# Altium schematic sheet Sheet1.SchDoc
size A3; Organization: Altium Limited; Address1: L3, 12a Rodborough Rd; Address2: Frenchs Forest; Address3: NSW; Address4: Australia 2086
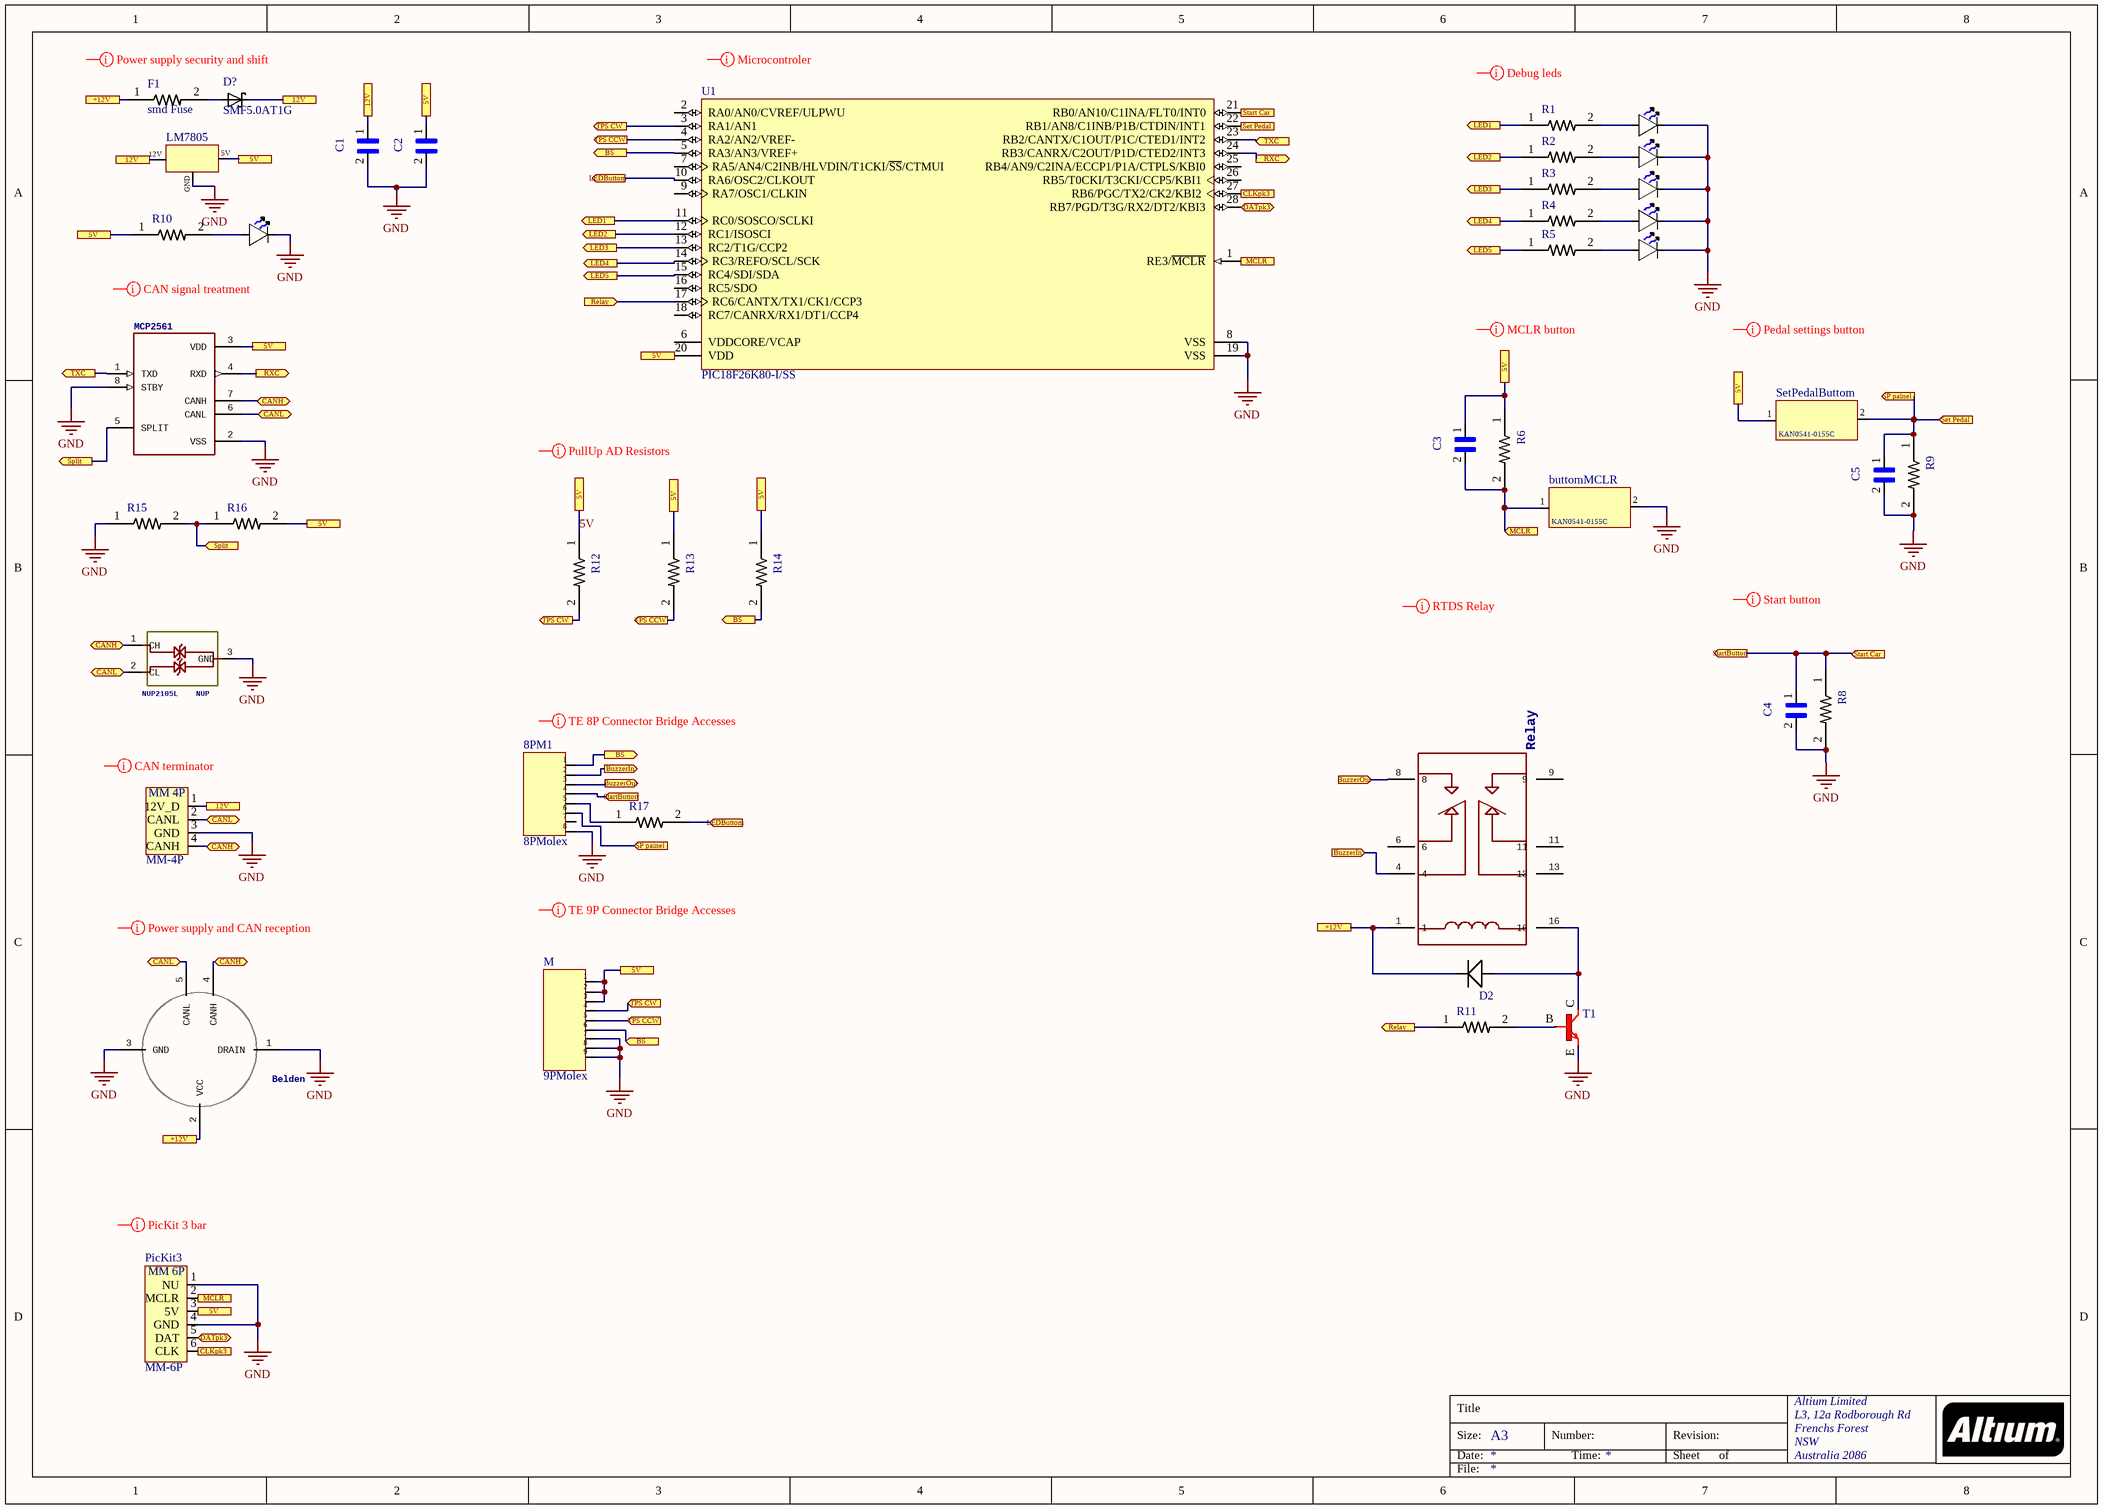
[diagram p0: Sheet1.SchDoc]

## Parts
8PM1  8PMolex  [PCBComponent_1]
Belden  RSWF-5  [RSWF-5]  (value not drawn)
buttomMCLR  ButtomSMD  [PCBComponent_1]  (value not drawn)
C1  10uF  [*CAPMP3216X166]  (value not drawn)
C2  (no value)  [*CAPMP3216X166]
C3  33uF  [*CAPMP3216X166]  (value not drawn)
C4  33uF  [*CAPMP3216X166]  (value not drawn)
C5  33uF  [*CAPMP3216X166]  (value not drawn)
D2  SMD-DIODE-SWITCHING-75V-150MA(D1206)  [*LED-1206_SMD-DIODE-SWITCHING-75V-150MA(D1206)(Primary)]  (value not drawn)
D?  SMF5.0AT1G  [*SOD123FL_SMF5.0AT1G(Primary)]
F1  smd Fuse  [*RESC3216X125N]
LED1  LED1206  [PCBComponent_1]  (value not drawn)
LED2  LED1206  [PCBComponent_1]  (value not drawn)
LED3  LED1206  [PCBComponent_1]  (value not drawn)
LED4  LED1206  [PCBComponent_1]  (value not drawn)
LED5  LED1206  [PCBComponent_1]  (value not drawn)
LED6  LED1206  [PCBComponent_1]  (value not drawn)
LM7805  Component_1  [PCBComponent_1]  (value not drawn)
M  9PMolex  [PCBComponent_1]
MCP2561  MCP2561 Series High-Speed 1 Mbps 5 V 5 uA CAN Transceiver - SOIC-8  [SOIC127P600X175-8N]  (value not drawn)
MM4P  MM-4P  [MICROMATCH-4]
NUP  NUP2105L  [NUP2105L]
PicKit3  MM-6P  [MICROMATCH-6]
R1  330R  [*RESC3216X90]  (value not drawn)
R2  330R  [*RESC3216X90]  (value not drawn)
R3  330R  [*RESC3216X90]  (value not drawn)
R4  330R  [*RESC3216X90]  (value not drawn)
R5  330R  [*RESC3216X90]  (value not drawn)
R6  1700R  [*RESC3216X90]  (value not drawn)
R8  1700R  [*RESC3216X90]  (value not drawn)
R9  1700R  [*RESC3216X90]  (value not drawn)
R10  1700R  [*RESC3216X90]  (value not drawn)
R11  1700R  [*RESC3216X90]  (value not drawn)
R12  CRCW120635K7FKEA  [*RESC3216X90]  (value not drawn)
R13  CRCW120635K7FKEA  [*RESC3216X90]  (value not drawn)
R14  CRCW120635K7FKEA  [*RESC3216X90]  (value not drawn)
R15  CRCW120635K7FKEA  [*RESC3216X90]  (value not drawn)
R16  CRCW120635K7FKEA  [*RESC3216X90]  (value not drawn)
R17  CRCW120635K7FKEA  [*RESC3216X90]  (value not drawn)
Relay  â€¢ Ideal para uso em telecomunicaÃ§Ãµes â€¢ 2 contatos reversÃ­veis bifurcados â€¢ ComutaÃ§Ã£o de cargas a partir de 10 ï­A â€¢ Montagem direta em circuito impresso â€¢ Selado â€¢ Homologado ULâ€¢ 2 contatos reversÃ­veis bifurcados â€¢ ComutaÃ§Ã£o de cargas a partir de 10 ï­A â€¢ Montagem direta em circuito impresso â€¢ Selado â€¢ Homologado UL  [ML2RC5]  (value not drawn)
SetPedalButtom  ButtomSMD  [PCBComponent_1]  (value not drawn)
T1  TBJSOT23  [PCBComponent_1]  (value not drawn)
U1  PIC18F26K80-I/SS  [MCHP-SSOP-SS28_L]

## Ports
5V, 12V, +12V, BS (in), BS (out), BuzzerIn (in), BuzzerIn (out), BuzzerOut (in), BuzzerOut (out), CANH (bidir), CANL (bidir), CLKpk3 (in), CLKpk3 (out), DATpk3 (bidir), LED1 (out), LED2 (out), LED3 (out), LED4 (out), LED5 (out), LEDButtom (in), LEDButtom (out), MCLR (in), MCLR (out), Relay (in), Relay (out), RXC (out), Set Pedal (in), Set Pedal (out), SP painel (in), SP painel (out), Split (in), Split (out), Start Car (in), Start Car (out), StartButton (in), StartButton (out), TPS CCW (in), TPS CCW (out), TPS CW (in), TPS CW (out), TXC (in), TXC (out)

## Nets
GND: 8PM1.8 Belden.1(DRAIN) Belden.3(GND) buttomMCLR.2(out) C1.2 C2.2 C4.2 C5.2 LED1.2(OUT) LED2.2(OUT) LED3.2(OUT) LED4.2(OUT) LED5.2(OUT) LED6.2(OUT) LM7805.GND M.7 M.8 M.9 MCP2561.2(VSS) MCP2561.8(STBY) MM4P.3(GND) NUP.3(GND) PicKit3.1(NU) PicKit3.4(GND) R8.2 R9.2 R15.1 T1.E U1.8(VSS) U1.19(VSS)
5V: C2.1 C3.1 LM7805.5V M.1 M.2 M.3 MCP2561.3(VDD) PicKit3.3(5V) R6.1 R10.1 R12.1 R13.1 R14.1 R16.2 SetPedalButtom.1(in) U1.20(VDD) ; port 5V
12V: C1.1 D?.C LM7805.12V MM4P.1(12V_D) ; port 12V
+12V: Belden.2(VCC) D2.NEG F1.1 Relay.1 ; port +12V
BS: 8PM1.1 M.6 R14.2 U1.5(RA3/AN3/VREF+) ; port BS
BuzzerIn: 8PM1.2 Relay.4 ; port BuzzerIn
BuzzerOut: 8PM1.3 Relay.8 ; port BuzzerOut
CANH: Belden.4(CANH) MCP2561.7(CANH) MM4P.4(CANH) NUP.1(CH) ; port CANH
CANL: Belden.5(CANL) MCP2561.6(CANL) MM4P.2(CANL) NUP.2(CL) ; port CANL
CLKpk3: PicKit3.6(CLK) U1.27(RB6/PGC/TX2/CK2/KBI2) ; port CLKpk3
DATpk3: PicKit3.5(DAT) U1.28(RB7/PGD/T3G/RX2/DT2/KBI3) ; port DATpk3
LED1: R1.1 U1.11(RC0/SOSCO/SCLKI) ; port LED1
LED2: R2.1 U1.12(RC1/ISOSCI) ; port LED2
LED3: R3.1 U1.13(RC2/T1G/CCP2) ; port LED3
LED4: R4.1 U1.14(RC3/REFO/SCL/SCK) ; port LED4
LED5: R5.1 U1.15(RC4/SDI/SDA) ; port LED5
LEDButtom: R17.2 U1.10(RA6/OSC2/CLKOUT) ; port LEDButtom
MCLR: buttomMCLR.1(in) C3.2 PicKit3.2(MCLR) R6.2 U1.1(RE3/~{MCLR}) ; port MCLR
Relay: R11.1 U1.17(RC6/CANTX/TX1/CK1/CCP3) ; port Relay
RXC: MCP2561.4(RXD) U1.24(RB3/CANRX/C2OUT/P1D/CTED2/INT3) ; port RXC
Set Pedal: 8PM1.6 C5.1 R9.1 SetPedalButtom.2(out) U1.22(RB1/AN8/C1INB/P1B/CTDIN/INT1) ; port Set Pedal, port SP painel
Split: MCP2561.5(SPLIT) R15.2 R16.1 ; port Split
Start Car: 8PM1.4 C4.1 R8.1 U1.21(RB0/AN10/C1INA/FLT0/INT0) ; port Start Car, port StartButton
TPS CCW: M.5 R13.2 U1.4(RA2/AN2/VREF-) ; port TPS CCW
TPS CW: M.4 R12.2 U1.3(RA1/AN1) ; port TPS CW
TXC: MCP2561.1(TXD) U1.23(RB2/CANTX/C1OUT/P1C/CTED1/INT2) ; port TXC
Net8PM1_5: 8PM1.5 R17.1
NetD2_POS: D2.POS Relay.16 T1.C
NetD?_A: D?.A F1.2
NetLED1_1: LED1.1(IN) R1.2
NetLED2_1: LED2.1(IN) R2.2
NetLED3_1: LED3.1(IN) R3.2
NetLED4_1: LED4.1(IN) R4.2
NetLED5_1: LED5.1(IN) R5.2
NetLED6_1: LED6.1(IN) R10.2
NetR11_2: R11.2 T1.B

Not connected (* = marked no-connect by the designer): 8PM1 7; Relay 6 9 11 13; U1 2(RA0/AN0/CVREF/ULPWU) 6(VDDCORE/VCAP) 7(RA5/AN4/C2INB/HLVDIN/T1CKI/~{SS}/CTMUI) 9(RA7/OSC1/CLKIN) 16(RC5/SDO) 18(RC7/CANRX/RX1/DT1/CCP4) 25(RB4/AN9/C2INA/ECCP1/P1A/CTPLS/KBI0) 26(RB5/T0CKI/T3CKI/CCP5/KBI1)

## Layout directives
mark named Power supply security and shift: (no net found under the mark)
mark named CAN signal treatment: (no net found under the mark)
mark named Power supply and CAN reception: (no net found under the mark)
mark named CAN terminator: (no net found under the mark)
mark named Microcontroler: (no net found under the mark)
mark named Debug leds: (no net found under the mark)
mark named MCLR button: (no net found under the mark)
mark named Pedal settings button: (no net found under the mark)
mark named Start button: (no net found under the mark)
mark named PicKit 3 bar: (no net found under the mark)
mark named RTDS Relay: (no net found under the mark)
mark named PullUp AD Resistors: (no net found under the mark)
mark named TE 8P Connector Bridge Accesses: (no net found under the mark)
mark named TE 9P Connector Bridge Accesses: (no net found under the mark)

## Notes on the sheet
- Title
- Size:
- Date:
- A3
- Number:
- Time:
- Revision:
- Sheet
- of
- File:
- (in symbol ButtomSMD) KAN0541-0155C
- (in symbol MM-4P) MM 4P
- (in symbol MM-6P) MM 6P

## Library data of the parts
Belden = RSWF-5: GateName_1: G$1; SymbolName_1: RSWF-5; LibraryName: RSWF-5; DeviceSetName: RSWF-5; Package: RSWF-5
C1-C5 = 12061A102KAT2A: / 1206 1 nF 100 V Â±10% Tolerance C0G/NP0 SMT Multilayer Ceramic Capacitor /; MF: AVX; Digi-Key_Purchase_URL: https://www.digikey.com/product-detail/en/avx-corporation/12061A102KAT2A/478-5168-1-ND/1913258?utm_source=snapeda&utm_medium=aggregator&utm_campaign=symbol; Digi-Key_Part_Number: 478-5168-1-ND; Package: 1206 AVX; SnapEDA_Link: https://www.snapeda.com/parts/12061A102KAT2A/AVX/view-part/?ref=snap; MP: 12061A102KAT2A; Value: *
D2 = SMD-DIODE-SWITCHING-75V-150MA(D1206): Diode Small Signal Switching 100V 0.15A 2-Pin Case 1206; MP: CD1206-S01575; MF: Bourns; Package: 1206 Bourns; Price: None; Availability: Unavailable; SnapEDA_Link: https://www.snapeda.com/parts/CD1206-S01575/Bourns%20-%20J.W.%20Miller/view-part/?ref=snap; Value: *
D? = SMF5.0AT1G: Tvs Diode, 200w, 5v, Sod-123fl, Full Reel; MF: Littelfuse Inc.; Price: None; SnapEDA_Link: https://www.snapeda.com/parts/SMF5.0AT1G/Littelfuse%20Inc./view-part/?ref=snap; Package: SOD-123 Littelfuse; Availability: Unavailable; MP: SMF5.0AT1G; Value: *
F1 = 0ZCA0075FF2G: PTC Resettable Fuse 0.75A_hold_ 1.5A_trip_ 6VDC 100A 0.6W 0.2s 0.09Ohm SMD Solder Pad 1206 T/R; MF: Bel Fuse; Package: 1206 Bel Fuse; MP: 0ZCA0075FF2G; Price: None; Availability: Unavailable; SnapEDA_Link: https://www.snapeda.com/parts/0ZCA0075FF2G/Bel%20Fuse%20Inc./view-part/?ref=snap; Value: *
MCP2561 = MCP2561-E/SN: GateName_1: G$1; MF: Microchip; SymbolName_1: MCP2561-E/SN; LibraryName: MCP2561-E_SN; DeviceSetName: MCP2561-E/SN; Package: SOIC127P600X175-8N; Availability: Unavailable; MP: MCP2561-E/SN; Package: SOIC-8 Microchip; Price: None
NUP = NUP2105L: GateName_1: G$1; SymbolName_1: NUP2105L; LibraryName: NUP2105L-; DeviceSetName: NUP2105L; Package: NUP2105L
R1-R6 R8-R17 = CRCW120635K7FKEA: / CRCW Series 1206 0.25 W 35.7 kOhm Â±1 % Â±100 ppm/K SMT Thick Film Chip Resistor /; MF: Vishay Dale; Availability: Unavailable; SnapEDA_Link: https://www.snapeda.com/parts/CRCW120635K7FKEA/Vishay%20Dale/view-part/?ref=snap; Price: None; Package: 1206 Vishay; MP: CRCW120635K7FKEA; Value: *
Relay = ML2RC-5V: GateName_1: G$1; SymbolName_1: ML2R5V; LibraryName: ML2RC5; DeviceSetName: ML2RC-5V; Package: ML2RC5
U1 = PIC18F26K80-I/SS: Enhanced Flash Microcontroller with ECAN(TM) and nanoWatt XLP Technology, 64 MHz, 24 I/O, -40 to 85 degC, 28-pin SSOP (SS28), Tube; Manufacturer: Microchip; # of A/D Channels: 8; Digital Communication: 2 -A/E/USART, 0 -SPI, 1 -MSSP(SPI/I2C); EEPROM Data Memory (bytes): 1024; I/O Pins: 24; Internal Oscillator: 16 MHz, 31 kHz; Max. CPU Speed MHz: 64; Operation Voltage Range: 1.8V - 5.5V; Program Memory KWords: 32; RAM: 3648; Timers: 2 - 8-bit, 3 - 16-bit, 0 - 32-bit; DatasheetVersion: Rev. F; PackageVersion: C04-073B, 12/2012; PackageReference: SSOP-SS28; PackageDescription: 28-Lead Plastic Shrink Small Outline, 10.2 x 5.3 mm Body, 0.65 mm Pitch; Supplier 1: Digi-Key; Supplier Part Number 1: PIC18F26K80-I/SS-ND; Supplier 2: Farnell; Supplier Part Number 2: 1823166; Supplier 3: Newark; Supplier Part Number 3: 76R6688; Supplier 4: Newark; Supplier Part Number 4: 82T9596; Supplier 5: Mouser; Supplier Part Number 5: 579-PIC18F26K80-I/SS; Memory Type: Flash; Packing: TUBE; Program Memory KBytes: 64; RoHS: TRUE; Mounting Technology: Surface Mount; PartNumber: PIC18F26K80-I/SS; ComponentLink1Description: Datasheet; ComponentLink1URL: http://ww1.microchip.com/downloads/en/DeviceDoc/39977f.pdf; ComponentLink2Description: Package Specification; ComponentLink2URL: http://www.microchip.com/stellent/groups/techpub_sg/documents/packagingspec/en012702.pdf; ComponentLink3Description: URL Link1; ComponentLink3URL: Product URL:http://www.microchip.com/datasheet/PIC18F26K80